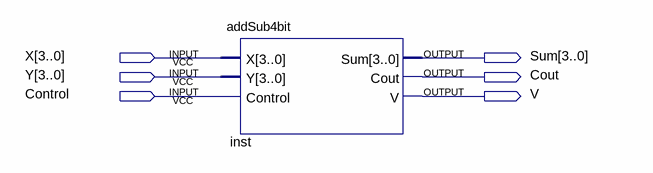
[diagram p0: schematic sheet]
// Quartus schematic testADDER.bdf as structural Verilog: 1 symbols, 6 pins
module testADDER (
  input  [3:0] X,
  input  [3:0] Y,
  input  Control,
  output [3:0] Sum,
  output Cout,
  output V
);

  addSub4bit inst (.X(X), .Y(Y), .Control(Control), .Sum(Sum), .Cout(Cout), .V(V));
endmodule
